# EAGLE design LED board (EAGLE 9.2.2)
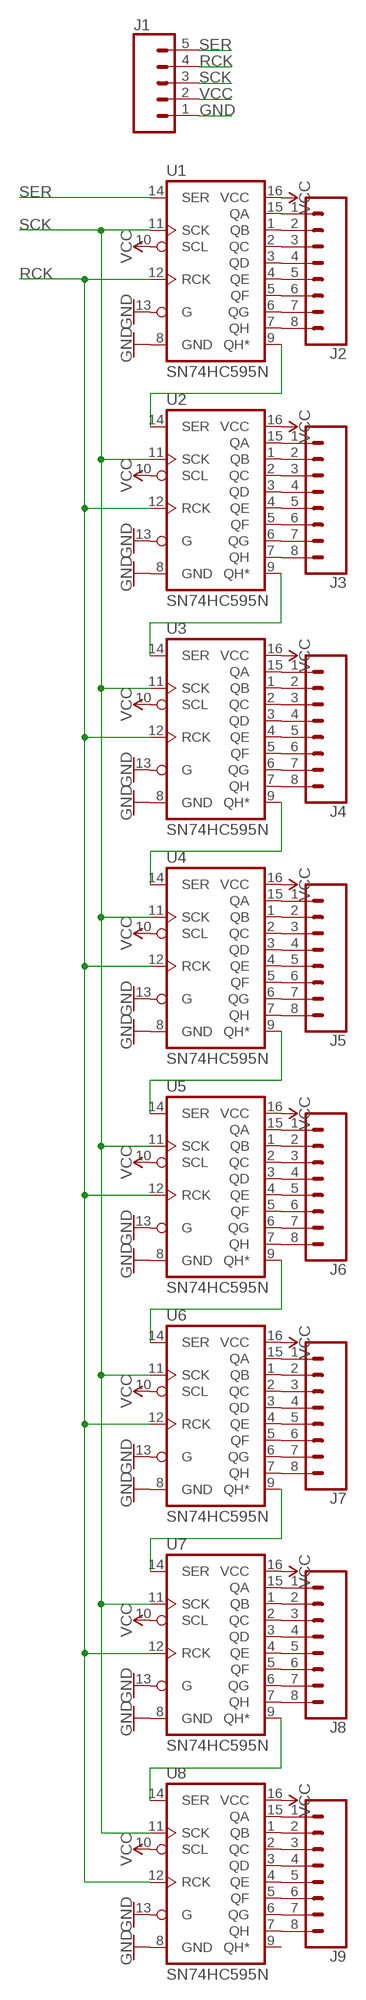
[diagram p0: schematic, sheet 1]

## Parts
J1  CONN_05  [1X05]
J2  CONN_08"  [1X08]
J3  CONN_08"  [1X08]
J4  CONN_08"  [1X08]
J5  CONN_08"  [1X08]
J6  CONN_08"  [1X08]
J7  CONN_08"  [1X08]
J8  CONN_08"  [1X08]
J9  CONN_08"  [1X08]
U1  SN74HC595N  74HC595N  [DIP16]
U2  SN74HC595N  74HC595N  [DIP16]
U3  SN74HC595N  74HC595N  [DIP16]
U4  SN74HC595N  74HC595N  [DIP16]
U5  SN74HC595N  74HC595N  [DIP16]
U6  SN74HC595N  74HC595N  [DIP16]
U7  SN74HC595N  74HC595N  [DIP16]
U8  SN74HC595N  74HC595N  [DIP16]

## Nets
GND: J1.1 U1.8(GND) U1.13(G) U2.8(GND) U2.13(G) U3.8(GND) U3.13(G) U4.8(GND) U4.13(G) U5.8(GND) U5.13(G) U6.8(GND) U6.13(G) U7.8(GND) U7.13(G) U8.8(GND) U8.13(G)
N$1: U1.9(QH*) U2.14(SER)
N$2: U2.9(QH*) U3.14(SER)
N$3: U3.9(QH*) U4.14(SER)
N$4: U4.9(QH*) U5.14(SER)
N$5: U5.9(QH*) U6.14(SER)
N$6: U6.9(QH*) U7.14(SER)
N$7: U7.9(QH*) U8.14(SER)
N$8: J2.1 U1.15(QA)
N$9: J2.2 U1.1(QB)
N$10: J2.3 U1.2(QC)
N$11: J2.4 U1.3(QD)
N$12: J2.5 U1.4(QE)
N$13: J2.6 U1.5(QF)
N$14: J2.7 U1.6(QG)
N$15: J2.8 U1.7(QH)
N$16: J3.1 U2.15(QA)
N$17: J3.2 U2.1(QB)
N$18: J3.3 U2.2(QC)
N$19: J3.4 U2.3(QD)
N$20: J3.5 U2.4(QE)
N$21: J3.6 U2.5(QF)
N$22: J3.7 U2.6(QG)
N$23: J3.8 U2.7(QH)
N$24: J4.1 U3.15(QA)
N$25: J4.2 U3.1(QB)
N$26: J4.3 U3.2(QC)
N$27: J4.4 U3.3(QD)
N$28: J4.5 U3.4(QE)
N$29: J4.6 U3.5(QF)
N$30: J4.7 U3.6(QG)
N$31: J4.8 U3.7(QH)
N$32: J5.1 U4.15(QA)
N$33: J5.2 U4.1(QB)
N$34: J5.3 U4.2(QC)
N$35: J5.4 U4.3(QD)
N$36: J5.5 U4.4(QE)
N$37: J5.6 U4.5(QF)
N$38: J5.7 U4.6(QG)
N$39: J5.8 U4.7(QH)
N$40: J6.1 U5.15(QA)
N$41: J6.2 U5.1(QB)
N$42: J6.3 U5.2(QC)
N$43: J6.4 U5.3(QD)
N$44: J6.5 U5.4(QE)
N$45: J6.6 U5.5(QF)
N$46: J6.7 U5.6(QG)
N$47: J6.8 U5.7(QH)
N$48: J7.1 U6.15(QA)
N$49: J7.2 U6.1(QB)
N$50: J7.3 U6.2(QC)
N$51: J7.4 U6.3(QD)
N$52: J7.5 U6.4(QE)
N$53: J7.6 U6.5(QF)
N$54: J7.7 U6.6(QG)
N$55: J7.8 U6.7(QH)
N$56: J8.1 U7.15(QA)
N$57: J8.2 U7.1(QB)
N$58: J8.3 U7.2(QC)
N$59: J8.4 U7.3(QD)
N$60: J8.5 U7.4(QE)
N$61: J8.6 U7.5(QF)
N$62: J8.7 U7.6(QG)
N$63: J8.8 U7.7(QH)
N$64: J9.1 U8.15(QA)
N$65: J9.2 U8.1(QB)
N$66: J9.3 U8.2(QC)
N$67: J9.4 U8.3(QD)
N$68: J9.5 U8.4(QE)
N$69: J9.6 U8.5(QF)
N$70: J9.7 U8.6(QG)
N$71: J9.8 U8.7(QH)
RCK: J1.4 U1.12(RCK) U2.12(RCK) U3.12(RCK) U4.12(RCK) U5.12(RCK) U6.12(RCK) U7.12(RCK) U8.12(RCK)
SCK: J1.3 U1.11(SCK) U2.11(SCK) U3.11(SCK) U4.11(SCK) U5.11(SCK) U6.11(SCK) U7.11(SCK) U8.11(SCK)
SER: J1.5 U1.14(SER)
VCC: J1.2 U1.10(SCL) U1.16(VCC) U2.10(SCL) U2.16(VCC) U3.10(SCL) U3.16(VCC) U4.10(SCL) U4.16(VCC) U5.10(SCL) U5.16(VCC) U6.10(SCL) U6.16(VCC) U7.10(SCL) U7.16(VCC) U8.10(SCL) U8.16(VCC)
Unconnected: U8.9(QH*)

## Library data of the parts
J1 = SparkFun-Connectors:CONN_05: Multi connection point. Often used as Generic Header-pin footprint for 0.1 inch spaced/style header connections On any of the 0.1 inch spaced packages, you can populate with these: Break Away Headers - Straight <https://www.sparkfun.com/products/116> (PRT-00116) Break Away Male Headers - Right Angle <https://www.sparkfun.com/products/553> (PRT-00553) Female Headers <https://www.sparkfun.com/products/115> (PRT-00115) Break Away Headers - Machine Pin <https://www.sparkfun.com/products/117> (PRT-00117) Break Away Female Headers - Swiss Machine Pin <https://www.sparkfun.com/products/743> (PRT-00743) For SCREWTERMINALS and SPRING TERMINALS visit here: Screw Terimnals on SparkFun.com <https://www.sparkfun.com/search/results?term=Screw+Terminals> (5mm/3.5mm/2.54mm spacing) This device is also useful as a general connection point to wire up your design to another part of your project. Our various solder wires solder well into these plated through hole pads. Hook-Up Wire - Assortment (Stranded, 22 AWG) <https://www.sparkfun.com/products/11375> (PRT-11375) Hook-Up Wire - Assortment (Solid Core, 22 AWG) <https://www.sparkfun.com/products/11367> (PRT-11367) View the entire wire category on our website here <https://www.sparkfun.com/categories/141> Special notes: Molex polarized connector foot print use with SKU : PRT-08231 with associated crimp pins and housings. 1MM SMD Version SKU: PRT-10208
J2-J9 = SparkFun-Connectors:CONN_08: Multi connection point. Often used as Generic Header-pin footprint for 0.1 inch spaced/style header connections On any of the 0.1 inch spaced packages, you can populate with these: Break Away Headers - Straight <https://www.sparkfun.com/products/116> (PRT-00116) Break Away Male Headers - Right Angle <https://www.sparkfun.com/products/553> (PRT-00553) Female Headers <https://www.sparkfun.com/products/115> (PRT-00115) Break Away Headers - Machine Pin <https://www.sparkfun.com/products/117> (PRT-00117) Break Away Female Headers - Swiss Machine Pin <https://www.sparkfun.com/products/743> (PRT-00743) Arduino Stackable Header - 8 Pin <https://www.sparkfun.com/products/9279> (PRT-09279) For SCREWTERMINALS and SPRING TERMINALS visit here: Screw Terimnals on SparkFun.com <https://www.sparkfun.com/search/results?term=Screw+Terminals> (5mm/3.5mm/2.54mm spacing) This device is also useful as a general connection point to wire up your design to another part of your project. Our various solder wires solder well into these plated through hole pads. Hook-Up Wire - Assortment (Stranded, 22 AWG) <https://www.sparkfun.com/products/11375> (PRT-11375) Hook-Up Wire - Assortment (Solid Core, 22 AWG) <https://www.sparkfun.com/products/11367> (PRT-11367) View the entire wire category on our website here <https://www.sparkfun.com/categories/141> Special notes: Molex polarized connector foot print use with SKU : PRT-08231 with associated crimp pins and housings. 1MM SMD Version SKU: PRT-10208 NOTES ON THE VARIANTS LOCK and LOCK_LONGPADS... This footprint was designed to help hold the alignment of a through-hole component (i.e. 6-pin header) while soldering it into place. You may notice that each hole has been shifted either up or down by 0.005 of an inch from it's more standard position (which is a perfectly straight line). This slight alteration caused the pins (the squares in the middle) to touch the edges of the holes. Because they are alternating, it causes a "brace" to hold the component in place. 0.005 has proven to be the perfect amount of "off-center" position when using our standard breakaway headers. Although looks a little odd when you look at the bare footprint, once you have a header in there, the alteration is very hard to notice. Also,if you push a header all the way into place, it is covered up entirely on the bottom side.; PROD_ID: CONN-08438
U1-U8 = SparkFun-IC-Logic:74*595: 8-Bit Shift Register (Serial to Parallel) Datasheet <http://cdn.sparkfun.com/datasheets/BreakoutBoards/MM74HC595.pdf> SparkFun Products SparkFun Shift Register Breakout - 74HC595 <https://www.sparkfun.com/products/10680> (BOB-10680); PROD_ID: IC-13123

## Board
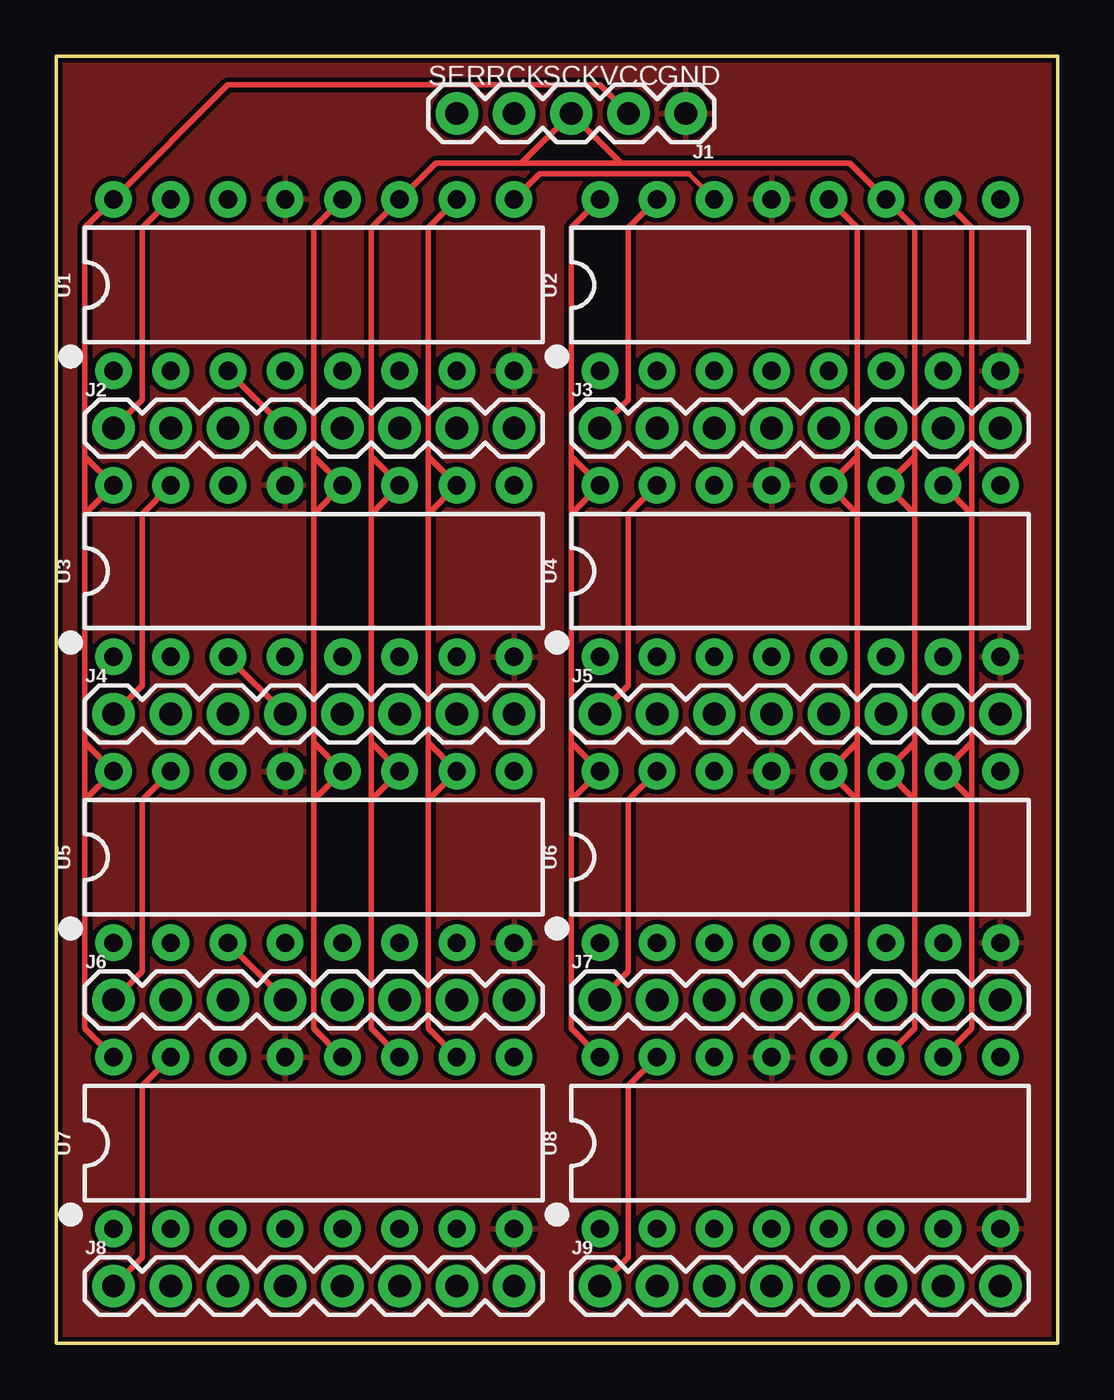
[diagram p1: board, top side]
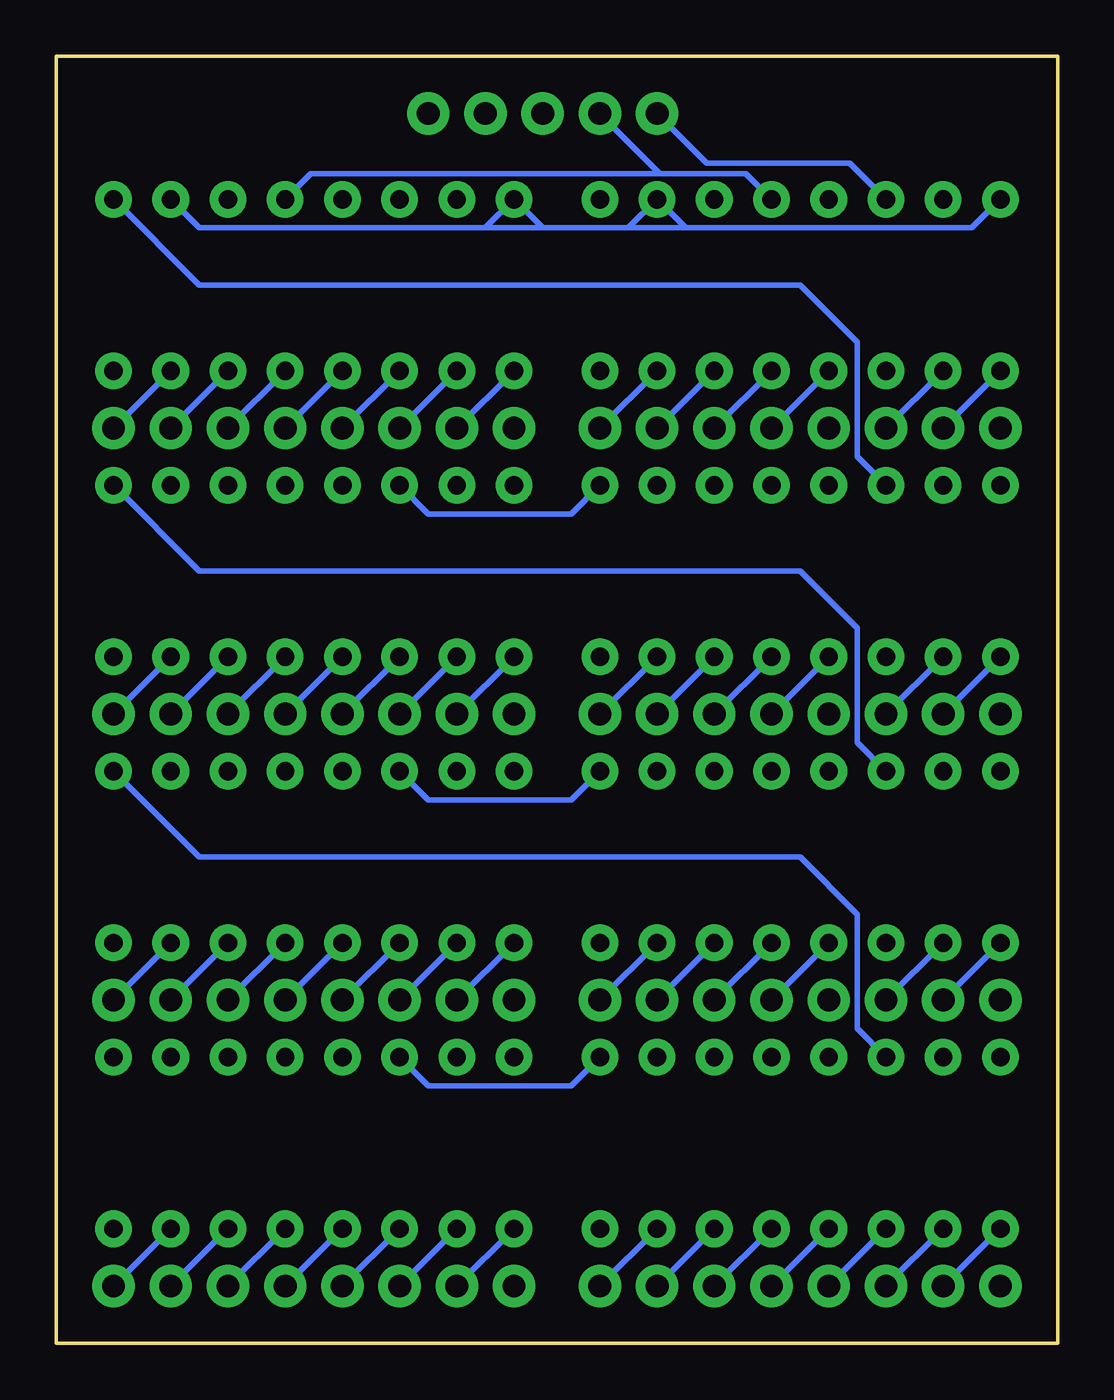
[diagram p2: board, bottom side, seen from below]

Size 44.45 x 57.15 mm. Coordinates in mm from the lower left corner, seen from the top.
Outline: 0,0 44.45,0 44.45,57.15 0,57.15 0,0
Copper layers (1*16): Top 0.035mm / dielectric 1.5mm / Bottom 0.035mm
Design rules "SparkFun": minimum track width 8mil, minimum drill 20mil, track to track 8mil, track to pad 8mil, pad to pad 8mil, via to via 8mil, smd to smd 8mil, copper to edge 8mil, drill to drill 8mil, minimum pad ring 12mil, minimum via ring 10mil, stop-mask expansion 4mil, vias tented up to drill 20mil, thermal gap 10mil

### Footprints (pad centres in the part's own frame; a part is rotated, then mirrored left to right if it is on the bottom)
1X05 = drill 1.016 pad 1.88: 1 0,0; 2 2.54,0; 3 5.08,0; 4 7.62,0; 5 10.16,0
1X08 = drill 1.016 pad 1.88: 1 0,0; 2 2.54,0; 3 5.08,0; 4 7.62,0; 5 10.16,0; 6 12.7,0; 7 15.24,0; 8 17.78,0
DIP16 = drill 0.813 pad 1.626: 1 -8.89,-3.81; 2 -6.35,-3.81; 3 -3.81,-3.81; 4 -1.27,-3.81; 5 1.27,-3.81; 6 3.81,-3.81; 7 6.35,-3.81; 8 8.89,-3.81; 9 8.89,3.81; 10 6.35,3.81; 11 3.81,3.81; 12 1.27,3.81; 13 -1.27,3.81; 14 -3.81,3.81; 15 -6.35,3.81; 16 -8.89,3.81

### Placement (x,y rotation side)
J1  27.94,54.61 180 top
J2  2.54,40.64 0 top
J3  24.13,40.64 0 top
J4  2.54,27.94 0 top
J5  24.13,27.94 0 top
J6  2.54,15.24 0 top
J7  24.13,15.24 0 top
J8  2.54,2.54 0 top
J9  24.13,2.54 0 top
U1  11.43,46.99 0 top
U2  33.02,46.99 0 top
U3  11.43,34.29 0 top
U4  33.02,34.29 0 top
U5  11.43,21.59 0 top
U6  33.02,21.59 0 top
U7  11.43,8.89 0 top
U8  33.02,8.89 0 top

### Tracks (layer width: path | path; a pad name or v marks a point on that pad's centre or on a via)
GND
  pour Top: 0,57.15 44.45,57.15 44.45,0 0,0
N$1
  Top 0.203: 28.07,51.94 U2.14
  Top 0.254: 28.07,51.94 21.46,51.94 U1.9
N$2
  Bottom 0.254: U2.9 38.1,46.99 11.43,46.99 8.89,44.45 8.89,39.37 U3.14
N$3
  Bottom 0.254: U3.9 21.59,36.83 27.94,36.83 U4.14
N$4
  Bottom 0.254: U4.9 38.1,34.29 11.43,34.29 8.89,31.75 8.89,26.67 U5.14
N$5
  Bottom 0.254: U5.9 21.59,24.13 27.94,24.13 U6.14
N$6
  Bottom 0.254: U6.9 38.1,21.59 11.43,21.59 8.89,19.05 8.89,13.97 U7.14
N$7
  Bottom 0.254: U7.9 21.59,11.43 27.94,11.43 U8.14
N$8
  Top 0.254: U1.15 3.81,49.53 3.81,41.91 J2.1
N$9
  Bottom 0.254: U1.1 J2.2
N$10
  Bottom 0.254: U1.2 J2.3
N$11
  Top 0.254: U1.3 J2.4
N$12
  Bottom 0.254: U1.4 J2.5
N$13
  Bottom 0.254: U1.5 J2.6
N$14
  Bottom 0.254: U1.6 J2.7
N$15
  Bottom 0.254: U1.7 J2.8
N$16
  Top 0.254: U2.15 25.4,49.53 25.4,41.91 J3.1
N$17
  Bottom 0.254: U2.1 J3.2
N$18
  Bottom 0.254: U2.2 J3.3
N$19
  Bottom 0.254: U2.3 J3.4
N$20
  Bottom 0.254: U2.4 J3.5
N$21
  Bottom 0.254: U2.5 J3.6
N$22
  Bottom 0.254: U2.6 J3.7
N$23
  Bottom 0.254: U2.7 J3.8
N$24
  Top 0.254: U3.15 3.81,36.83 3.81,29.21 J4.1
N$25
  Bottom 0.254: U3.1 J4.2
N$26
  Bottom 0.254: U3.2 J4.3
N$27
  Top 0.254: U3.3 J4.4
N$28
  Bottom 0.254: U3.4 J4.5
N$29
  Bottom 0.254: U3.5 J4.6
N$30
  Bottom 0.254: U3.6 J4.7
N$31
  Bottom 0.254: U3.7 J4.8
N$32
  Top 0.254: U4.15 25.4,36.83 25.4,29.21 J5.1
N$33
  Bottom 0.254: U4.1 J5.2
N$34
  Bottom 0.254: U4.2 J5.3
N$35
  Bottom 0.254: U4.3 J5.4
N$36
  Bottom 0.254: U4.4 J5.5
N$37
  Bottom 0.254: U4.5 J5.6
N$38
  Bottom 0.254: U4.6 J5.7
N$39
  Bottom 0.254: U4.7 J5.8
N$40
  Top 0.254: U5.15 3.81,24.13 3.81,16.51 J6.1
N$41
  Bottom 0.254: U5.1 J6.2
N$42
  Bottom 0.254: U5.2 J6.3
N$43
  Top 0.254: U5.3 J6.4
N$44
  Bottom 0.254: U5.4 J6.5
N$45
  Bottom 0.254: U5.5 J6.6
N$46
  Bottom 0.254: U5.6 J6.7
N$47
  Bottom 0.254: U5.7 J6.8
N$48
  Top 0.254: U6.15 25.4,24.13 25.4,16.51 J7.1
N$49
  Bottom 0.254: U6.1 J7.2
N$50
  Bottom 0.254: U6.2 J7.3
N$51
  Bottom 0.254: U6.3 J7.4
N$52
  Bottom 0.254: U6.4 J7.5
N$53
  Bottom 0.254: U6.5 J7.6
N$54
  Bottom 0.254: U6.6 J7.7
N$55
  Bottom 0.254: U6.7 J7.8
N$56
  Top 0.254: U7.15 3.81,11.43 3.81,3.81 J8.1
N$57
  Bottom 0.254: U7.1 J8.2
N$58
  Bottom 0.254: U7.2 J8.3
N$59
  Bottom 0.254: U7.3 J8.4
N$60
  Bottom 0.254: U7.4 J8.5
N$61
  Bottom 0.254: U7.5 J8.6
N$62
  Bottom 0.254: U7.6 J8.7
N$63
  Bottom 0.254: U7.7 J8.8
N$64
  Top 0.254: U8.15 25.4,11.43 25.4,3.81 J9.1
N$65
  Bottom 0.254: U8.1 J9.2
N$66
  Bottom 0.254: U8.2 J9.3
N$67
  Bottom 0.254: U8.3 J9.4
N$68
  Bottom 0.254: U8.4 J9.5
N$69
  Bottom 0.254: U8.5 J9.6
N$70
  Bottom 0.254: U8.6 J9.7
N$71
  Bottom 0.254: U8.7 J9.8
RCK
  Top 0.254: U1.12 11.43,49.53 11.43,39.37 | 11.43,39.37 11.43,36.83 | 11.43,36.83 11.43,26.67 | 11.43,26.67 11.43,24.13 | 11.43,24.13 11.43,13.97 U7.12 | 11.43,24.13 U5.12 11.43,26.67 | 11.43,36.83 U3.12 11.43,39.37 | U8.12 34.29,13.44 35.56,14.71 35.56,24.13 | 35.56,24.13 U6.12 35.56,26.67 | 35.56,24.13 35.56,26.67 | 35.56,26.67 35.56,36.83 | 35.56,36.83 U4.12 35.56,39.37 | 35.56,36.83 35.56,39.37 | 35.56,39.37 35.56,49.53 U2.12
  Bottom 0.254: U1.12 13.84,51.94 17.65,51.94 | 17.65,51.94 33.15,51.94 U2.12 | 17.65,51.94 J1.4
SCK
  Top 0.203: 20.65,52.4 20.32,52.4 | 25.07,52.4 25.4,52.4
  Top 0.254: 13.97,39.37 13.97,49.53 U1.11 16.84,52.4 20.32,52.4 25.4,52.4 35.23,52.4 U2.11 38.1,49.53 38.1,39.37 | 13.97,39.37 13.97,36.83 | 13.97,36.83 13.97,26.67 | 13.97,26.67 13.97,24.13 | 13.97,24.13 13.97,13.97 U7.11 | 13.97,24.13 U5.11 13.97,26.67 | 13.97,36.83 U3.11 13.97,39.37 | 38.1,39.37 U4.11 38.1,36.83 | 38.1,39.37 38.1,36.83 | 38.1,36.83 38.1,26.67 | U6.11 38.1,26.67 | U6.11 | 38.1,26.67 38.1,24.13 | 38.1,24.13 38.1,13.97 U8.11 | 38.1,24.13 U6.11 | 20.65,52.4 J1.3 25.07,52.4
SER
  Bottom 0.254: J1.5 15.57,52.4 9.22,52.4 U1.14
VCC
  Top 0.254: 1.27,39.37 1.27,49.53 U1.16 7.62,55.88 24.13,55.88 J1.2 | 1.27,39.37 1.27,36.83 | 1.27,36.83 1.27,26.67 | 1.27,26.67 1.27,24.13 | 1.27,24.13 1.27,13.97 U7.16 | 1.27,39.37 U3.16 1.27,36.83 | 1.27,26.67 U5.16 1.27,24.13 | U1.10 16.51,49.53 16.51,39.37 | 16.51,39.37 16.51,36.83 | 16.51,36.83 16.51,26.67 | 16.51,26.67 16.51,24.13 | 16.51,24.13 16.51,13.97 U7.10 | 16.51,24.13 U5.10 16.51,26.67 | 16.51,36.83 U3.10 16.51,39.37 | U2.16 22.86,49.53 22.86,39.37 | 22.86,39.37 22.86,36.83 | 22.86,36.83 22.86,26.67 | 22.86,26.67 22.86,24.13 | 22.86,24.13 22.86,13.97 U8.16 | 22.86,24.13 U6.16 22.86,26.67 | 22.86,36.83 U4.16 22.86,39.37 | U8.10 40.64,13.97 40.64,24.13 | 40.64,24.13 40.64,26.67 | 40.64,26.67 40.64,36.83 | 40.64,36.83 40.64,39.37 | 40.64,39.37 40.64,49.53 U2.10 | 40.64,39.37 U4.10 40.64,36.83 | 40.64,24.13 U6.10 40.64,26.67
  Bottom 0.254: U1.16 3.81,49.53 16.51,49.53 | 16.51,49.53 19.05,49.53 | 19.05,49.53 22.86,49.53 | 22.86,49.53 25.4,49.53 | 25.4,49.53 38.1,49.53 U2.10 | 22.86,49.53 U2.16 25.4,49.53 | 19.05,49.53 U1.10 16.51,49.53

### Text on the board
tPlace: SER | RCK | SCK | VCC | GND